# Altium project IBB.PrjPcb (part 4 of 11)

## Sheet Input switch.SchDoc
size A3; SheetNumber: 5; SheetTotal: 8
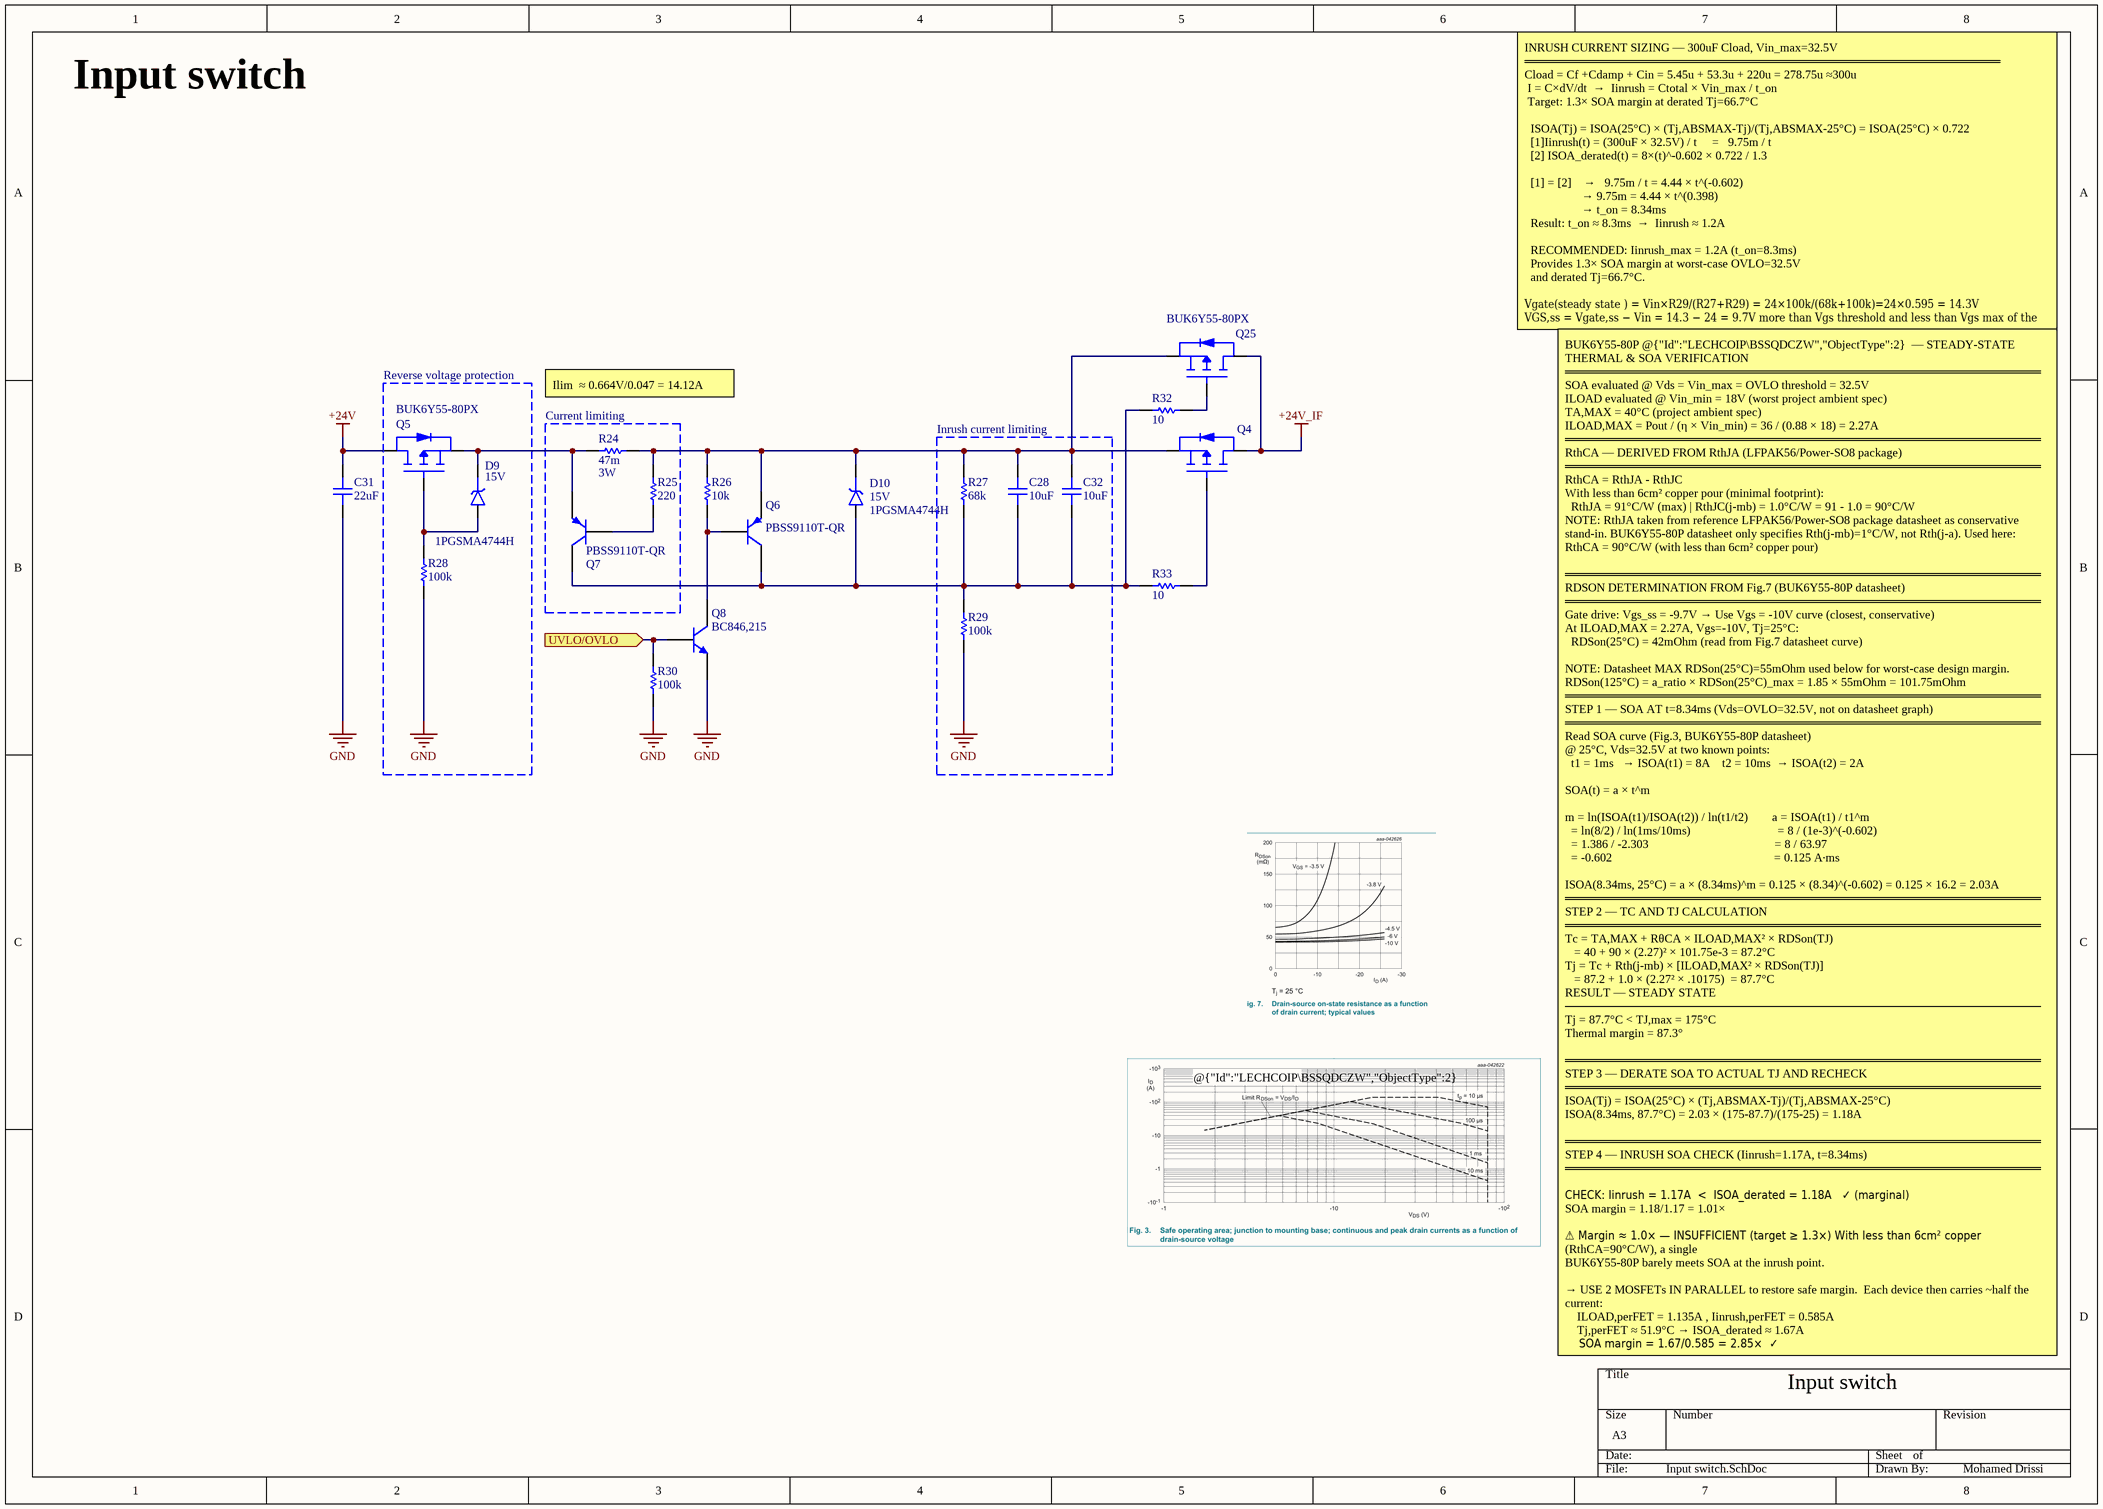
[diagram p3: Input switch.SchDoc]

### Parts
(Parts that share a designator on the sheet are numbered #1, #2 ... from top to bottom, then left to right.)
C28  Capacitance: 10uF  [cap_1210]  (hidden comment: GRM32EC72A106KE05L)
C31#1  Capacitance: 22uF  [CAP_1812]  (hidden comment: GMC43X7R226K50NT)
C32#1  Capacitance: 10uF  [cap_1210]  (hidden comment: GRM32EC72A106KE05L)
D9  1PGSMA4744H  Reference Voltage: 15V  [DO-214AC]
D10  1PGSMA4744H  Reference Voltage: 15V  [DO-214AC]
Q4  BUK6Y55-80PX  [LFPAK56]  (value not drawn)
Q5  BUK6Y55-80PX  [LFPAK56]
Q6  PBSS9110T-QR  [SOT23]
Q7  PBSS9110T-QR  [SOT23]
Q8  BC846,215  [sot23]
Q25  BUK6Y55-80PX  [LFPAK56]
R24  Power Rating: 3W  Resistance: 47m  [RES_1225]  (hidden comment: RLW73PA3FR047TE)
R25  Resistance: 220  [res_0603]  (hidden comment: CRGCQ0603J220R)
R26  Resistance: 10k  [res_0603]  (hidden comment: RC0603FR-0710KL)
R27  Resistance: 68k  [res_0603]  (hidden comment: CRGCQ0603J68K)
R28  Resistance: 100k  [res_0603]  (hidden comment: CRCW0603100KFKEA)
R29  Resistance: 100k  [res_0603]  (hidden comment: CRCW0603100KFKEA)
R30  Resistance: 100k  [res_0603]  (hidden comment: CRCW0603100KFKEA)
R32#1  Resistance: 10  [res_0603]  (hidden comment: RC0603FR-0710RL)
R33#1  Resistance: 10  [res_0603]  (hidden comment: RC0603FR-0710RL)

### Blocks framed on the sheet
Reverse voltage protection: D9 Q5 R28
Current limiting: Q7 R24 R25
Inrush current limiting: C28 C32#1 R27 R29

### Ports
UVLO/OVLO (in, see Main[1B], Protections[2C])

### Nets
+24V: C31#1.2 Q5.MB(D)
+24V_IF: Q4.MB(D) Q25.MB(D)
GND: C31#1.1 Q8.2(E) R28.1 R29.1 R30.1
NetC28_1: C28.1 C32#1.1 D10.A Q6.3(C) Q7.3(C) R27.1 R29.2 R32#1.2 R33#1.2
NetC28_2: C28.2 C32#1.2 D10.C Q4.1(S) Q6.2(E) Q25.1(S) R24.2 R25.2 R26.2 R27.2
NetD9_A: D9.A Q5.4(G) R28.2
NetD9_C: D9.C Q5.1(S) Q7.2(E) R24.1
NetQ4_4: Q4.4(G) R33#1.1
NetQ6_1: Q6.1(B) Q8.3(C) R26.1
NetQ7_1: Q7.1(B) R25.1
NetQ8_1: Q8.1(B) R30.2 ; port UVLO/OVLO
NetQ25_4: Q25.4(G) R32#1.1

### Notes on the sheet
- Input switch
- INRUSH CURRENT SIZING — 300uF Cload, Vin_max=32.5V
  ════════════════════════════════════════════════════════
  Cload = Cf +Cdamp + Cin = 5.45u + 53.3u + 220u = 278.75u ≈300u
  I = C×dV/dt  →  Iinrush = Ctotal × Vin_max / t_on
  Target: 1.3× SOA margin at derated Tj=66.7°C
  ISOA(Tj) = ISOA(25°C) × (Tj,ABSMAX-Tj)/(Tj,ABSMAX-25°C) = ISOA(25°C) × 0.722
  [1]Iinrush(t) = (300uF × 32.5V) / t     =   9.75m / t
  [2] ISOA_derated(t) = 8×(t)^-0.602 × 0.722 / 1.3
  [1] = [2]    →   9.75m / t = 4.44 × t^(-0.602)
  → 9.75m = 4.44 × t^(0.398)
  → t_on = 8.34ms
  Result: t_on ≈ 8.3ms  →  Iinrush ≈ 1.2A
  RECOMMENDED: Iinrush_max = 1.2A (t_on=8.3ms)
  Provides 1.3× SOA margin at worst-case OVLO=32.5V
  and derated Tj=66.7°C.
  Vgate(steady state ) = Vin​×R29​​/(R27​+R29​) = 24×100k​/(68k+100k)=24×0.595 = 14.3V
  VGS,ss ​= Vgate,ss ​− Vin​ = 14.3 − 24 = 9.7V more than Vgs threshold and less than Vgs max of the Mosfet
- Ilim  ≈ 0.664V/0.047 = 14.12A
- @{"Id":"LECHCOIP\BSSQDCZW","ObjectType":2} BUK6Y55-80PX
- BUK6Y55-80P @{"Id":"LECHCOIP\BSSQDCZW","ObjectType":2}  — STEADY-STATE THERMAL & SOA VERIFICATION
  ════════════════════════════════════════════════════════
  SOA evaluated @ Vds = Vin_max = OVLO threshold = 32.5V
  ILOAD evaluated @ Vin_min = 18V (worst project ambient spec)
  TA,MAX = 40°C (project ambient spec)
  ILOAD,MAX = Pout / (η × Vin_min) = 36 / (0.88 × 18) = 2.27A
  ════════════════════════════════════════════════════════
  RthCA — DERIVED FROM RthJA (LFPAK56/Power-SO8 package)
  ════════════════════════════════════════════════════════
  RthCA = RthJA - RthJC
  With less than 6cm² copper pour (minimal footprint):
  RthJA = 91°C/W (max) | RthJC(j-mb) = 1.0°C/W = 91 - 1.0 = 90°C/W
  NOTE: RthJA taken from reference LFPAK56/Power-SO8 package datasheet as conservative
  stand-in. BUK6Y55-80P datasheet only specifies Rth(j-mb)=1°C/W, not Rth(j-a). Used here: RthCA = 90°C/W (with less than 6cm² copper pour)
  ════════════════════════════════════════════════════════
  RDSON DETERMINATION FROM Fig.7 (BUK6Y55-80P datasheet)
  ════════════════════════════════════════════════════════
  Gate drive: Vgs_ss = -9.7V → Use Vgs = -10V curve (closest, conservative)
  At ILOAD,MAX = 2.27A, Vgs=-10V, Tj=25°C:
  RDSon(25°C) = 42mOhm (read from Fig.7 datasheet curve)
  NOTE: Datasheet MAX RDSon(25°C)=55mOhm used below for worst-case design margin.
  RDSon(125°C) = a_ratio × RDSon(25°C)_max = 1.85 × 55mOhm = 101.75mOhm
  ════════════════════════════════════════════════════════
  STEP 1 — SOA AT t=8.34ms (Vds=OVLO=32.5V, not on datasheet graph)
  ════════════════════════════════════════════════════════
  Read SOA curve (Fig.3, BUK6Y55-80P datasheet)
  @ 25°C, Vds=32.5V at two known points:
  t1 = 1ms   → ISOA(t1) = 8A    t2 = 10ms  → ISOA(t2) = 2A
  SOA(t) = a × t^m
  m = ln(ISOA(t1)/ISOA(t2)) / ln(t1/t2)        a = ISOA(t1) / t1^m
  = ln(8/2) / ln(1ms/10ms)                             = 8 / (1e-3)^(-0.602)
  = 1.386 / -2.303                                          = 8 / 63.97
  = -0.602                                                      = 0.125 A·ms
  ISOA(8.34ms, 25°C) = a × (8.34ms)^m = 0.125 × (8.34)^(-0.602) = 0.125 × 16.2 = 2.03A
  ════════════════════════════════════════════════════════
  STEP 2 — TC AND TJ CALCULATION
  ════════════════════════════════════════════════════════
  Tc = TA,MAX + RθCA × ILOAD,MAX² × RDSon(TJ)
  = 40 + 90 × (2.27)² × 101.75e-3 = 87.2°C
  Tj = Tc + Rth(j-mb) × [ILOAD,MAX² × RDSon(TJ)]
  = 87.2 + 1.0 × (2.27² × .10175)  = 87.7°C
  RESULT — STEADY STATE
  ────────────────────────────────────────────────────────
  Tj = 87.7°C < TJ,max = 175°C
  Thermal margin = 87.3°
  ════════════════════════════════════════════════════════
  STEP 3 — DERATE SOA TO ACTUAL TJ AND RECHECK
  ════════════════════════════════════════════════════════
  ISOA(Tj) = ISOA(25°C) × (Tj,ABSMAX-Tj)/(Tj,ABSMAX-25°C)
  ISOA(8.34ms, 87.7°C) = 2.03 × (175-87.7)/(175-25) = 1.18A
  ════════════════════════════════════════════════════════
  STEP 4 — INRUSH SOA CHECK (Iinrush=1.17A, t=8.34ms)
  ════════════════════════════════════════════════════════
  CHECK: Iinrush = 1.17A  <  ISOA_derated = 1.18A   ✓ (marginal)
  SOA margin = 1.18/1.17 = 1.01×
  ⚠ Margin ≈ 1.0× — INSUFFICIENT (target ≥ 1.3×) With less than 6cm² copper (RthCA=90°C/W), a single
  BUK6Y55-80P barely meets SOA at the inrush point.
  → USE 2 MOSFETs IN PARALLEL to restore safe margin.  Each device then carries ~half the current:
  ILOAD,perFET = 1.135A , Iinrush,perFET = 0.585A
  Tj,perFET ≈ 51.9°C → ISOA_derated ≈ 1.67A
  SOA margin = 1.67/0.585 = 2.85×  ✓
- Mohamed Drissi

### Library data of the parts
C28 C32#1 = Murata GRM32EC72A106KE05L: 100V 10uF X7S ±10% 1210 Multilayer Ceramic Capacitors MLCC - SMD/SMT ROHS; Manufacturer: Murata; Manufacturer Lifecycle Status: IN PRODUCTION; Supplier: RS; Supplier Part Number: 2478166P; Manufacturer Part Number: GRM32EC72A106KE05L; RoHS: Compliant; Category: Ceramic Capacitors; Stock: 6445; Pricing: 25=1,014, 50=0,9, 500=0,79 (EUR); Case/Package: 1210; Dielectric: X7S; Dielectric Material: Ceramic; Height: 2.5mm; Length: 3.2mm; Lifecycle Status: Production; Material: Ceramic; Max Operating Temperature: 125°C; Min Operating Temperature: -55°C; Mounting Technology: Surface Mount; Number of Terminals: 2; REACH SVHC: Yes; Schedule B: 8532240020, 8532240020|8532240020|8532240020|8532240020|8532240020|8532240020|8532240020|8532240020|8532240020|8532240020|8532240020|8532240020|8532240020|8532240020|8532240020|8532240020|8532240020|8532240020|8532240020|8532240020|8532240020|8532240020|8532240020|85; Thickness: 2.5mm; Tolerance: 10%; Voltage Rating: 100V; Voltage Rating (DC): 100V; Width: 2.5mm; ComponentLink1URL: https://datasheet.octopart.com:443/GRM32EC72A106KE05L-Murata-datasheet-141281477.pdf?src-supplier=Geoflip; ComponentLink1Description: https://datasheet.octopart.com:443/GRM32EC72A106KE05L-Murata-datasheet-141281477.pdf?src-supplier=Geoflip; ComponentLink2URL: https://datasheet.octopart.com:443/GRM32EC72A106KE05L-Murata-datasheet-165579666.pdf?src-supplier=TME; ComponentLink2Description: https://datasheet.octopart.com:443/GRM32EC72A106KE05L-Murata-datasheet-165579666.pdf?src-supplier=TME; ComponentLink3URL: https://datasheet.octopart.com:443/GRM32EC72A106KE05L-Murata-datasheet-140709574.pdf?src-supplier=Ciiva; ComponentLink3Description: https://datasheet.octopart.com:443/GRM32EC72A106KE05L-Murata-datasheet-140709574.pdf?src-supplier=Ciiva; ComponentLink4URL: https://datasheet.octopart.com:443/GRM32EC72A106KE05L-Murata-datasheet-138746841.pdf?src-supplier=Ciiva; ComponentLink4Description: https://datasheet.octopart.com:443/GRM32EC72A106KE05L-Murata-datasheet-138746841.pdf?src-supplier=Ciiva; ComponentLink5URL: https://datasheet.octopart.com:443/GRM32EC72A106KE05L-Murata-datasheet-102370999.pdf?src-supplier=HQonline; ComponentLink5Description: https://datasheet.octopart.com:443/GRM32EC72A106KE05L-Murata-datasheet-102370999.pdf?src-supplier=HQonline; ComponentLink6URL: https://datasheet.octopart.com/GRM32EC72A106KE05L-Murata-datasheet-12515295.pdf; ComponentLink6Description: https://datasheet.octopart.com/GRM32EC72A106KE05L-Murata-datasheet-12515295.pdf; ComponentLink7URL: https://datasheet.octopart.com/GRM32EC72A106KE05L-Murata-datasheet-12510076.pdf; ComponentLink7Description: https://datasheet.octopart.com/GRM32EC72A106KE05L-Murata-datasheet-12510076.pdf; ComponentLink8URL: https://datasheet.octopart.com/GRM32EC72A106KE05L-Murata-datasheet-11978611.pdf; ComponentLink8Description: https://datasheet.octopart.com/GRM32EC72A106KE05L-Murata-datasheet-11978611.pdf; ComponentLink9URL: https://datasheet.octopart.com/GRM32EC72A106KE05L-Murata-datasheet-10025737.pdf; ComponentLink9Description: https://datasheet.octopart.com/GRM32EC72A106KE05L-Murata-datasheet-10025737.pdf; ComponentLink10URL: https://datasheet.octopart.com/GRM32EC72A106KE05L-Murata-datasheet-8819587.pdf; ComponentLink10Description: https://datasheet.octopart.com/GRM32EC72A106KE05L-Murata-datasheet-8819587.pdf; ComponentLink11URL: http://sigma.octopart.com:80/reach_statement/Murata-company-16.pdf?src-supplier=Compliance+Statements; ComponentLink11Description: http://sigma.octopart.com:80/reach_statement/Murata-company-16.pdf?src-supplier=Compliance+Statements
C31#1 = Cal-chip GMC43X7R226K50NT: 1812 Mlcc 22UF 50V 10% X7R; Manufacturer: Cal-Chip Electronics; Supplier: DigiKey; Supplier Part Number: 4713-GMC43X7R226K50NTTR-ND; Manufacturer Part Number: GMC43X7R226K50NT; Category: Ceramic Capacitors; Stock: 3500; Pricing: 500=0,68284, 1000=0,64805, 1500=0,63062, 2500=0,61131, 3500=0,60001, 5000=0,58915 (USD)
D9 D10 = Taiwan semiconductor 1PGSMA4744H: Zener Diode, 15V V(Z), 5%, 1W, Silicon, Unidirectional, DO-214AC; Impedance: 14Ω; Number of Elements: 1; Peak Reverse Current: 1µA; Reverse Standoff Voltage: 11.4V; Zener Current: 17mA; Supplier: DigiKey; Supplier Part Number: 1801-1PGSMA4744HTR-ND; Manufacturer: Taiwan Semiconductor; Manufacturer Part Number: 1PGSMA4744H; RoHS: Compliant; Category: Zener Diodes; Stock: 7500; Pricing: 7500=0,09278, 15000=0,08793 (USD); China RoHS: Non-Compliant; Composition: Zener; Country of Origin: Mainland China, Taiwan; Export Control Classification Number (ECCN) Code: EAR99; Harmonized Tariff Schedule (HTS) Code: 8541.10.00.50; Introduction Date: 2021-03-02; Lifecycle Status: Production; Max Operating Temperature: 175°C; Max Power Dissipation: 1W; Min Operating Temperature: -55°C; Number of Terminals: 2; Polarity: Unidirectional; Ratings: AEC-Q101; REACH SVHC: No; Voltage Tolerance: 5%; ComponentLink1URL: https://datasheet.octopart.com:443/1PGSMA4744H-Taiwan-Semiconductor-datasheet-181255874.pdf?src-supplier=IHS; ComponentLink1Description: https://datasheet.octopart.com:443/1PGSMA4744H-Taiwan-Semiconductor-datasheet-181255874.pdf?src-supplier=IHS
Q4 Q5 Q25 = Nexp BUK6Y55-80PX: 80 V, P-channel Trench MOSFET; Manufacturer: Nexperia; Supplier: DigiKey; Supplier Part Number: 1727-BUK6Y55-80PXCT-ND; Manufacturer Part Number: BUK6Y55-80PX; RoHS: Compliant; Category: MOSFETs; Stock: 1568; Pricing: 1=1,14, 10=0,826, 25=0,7464, 100=0,6593, 250=0,61776, 500=0,59272 (USD); China RoHS: Non-Compliant; Export Control Classification Number (ECCN) Code: EAR99; Introduction Date: 2025-05-08; Lifecycle Status: Production; REACH SVHC: No
Q6 Q7 = NXP PBSS9110T-QR: Bipolar Transistors - BJT 100 V, 1 A PNP low VCEsat transistor; Manufacturer: Nexperia; Manufacturer Lifecycle Status: RELEASED FOR SUPPLY; Supplier: DigiKey; Supplier Part Number: 1727-PBSS9110T-QRTR-ND; Manufacturer Part Number: PBSS9110T-QR; Category: Uncategorized; Stock: 6000; Pricing: 3000=0,08942, 6000=0,08095, 9000=0,07663, 15000=0,07178, 21000=0,07176 (USD); Lifecycle Status: Production; ComponentLink1URL: https://datasheet.octopart.com:443/PBSS9110T-QR-Nexperia-datasheet-163260084.pdf?src-supplier=Nexperia; ComponentLink1Description: https://datasheet.octopart.com:443/PBSS9110T-QR-Nexperia-datasheet-163260084.pdf?src-supplier=Nexperia
Q8 = NXP BC846,215: BC846 Series 65 V 100 mA SMT NPN General Purpose Transistor - SOT-23; Manufacturer: Nexperia; Manufacturer Lifecycle Status: RELEASED FOR SUPPLY; Collector Base Voltage (VCBO): 80V; Collector Emitter Breakdown Voltage: 65V; Collector Emitter Saturation Voltage: 600mV; Element Configuration: Single; Emitter Base Voltage (VEBO): 6V; Frequency: 100MHz; hFE Min: 110; Max Collector Current: 100mA; Max Power Dissipation: 250mW; Number of Elements: 1; Supplier: RS; Supplier Part Number: 4842268P; Manufacturer Part Number: BC846,215; RoHS: Compliant; Category: BJTs; Stock: 24450; Pricing: 100=0,103, 250=0,091 (EUR); Case/Package: SOT-23; China RoHS: Compliant; Collector Emitter Voltage (VCEO): 65V; Contact Plating: Tin; Country of Origin: Mainland China; Export Control Classification Number (ECCN) Code: EAR99; Gain Bandwidth Product: 100MHz; Height: 1mm; Harmonized Tariff Schedule (HTS) Code: 8541.21.00.95; Introduction Date: 1997-09-01; Lead Free: Lead Free; Length: 3mm; Lifecycle Status: Production; Max Breakdown Voltage: 65V; Clock Frequency: 100MHz; Max Operating Temperature: 150°C; Min Operating Temperature: -65°C; Mounting Technology: Surface Mount; Pins: 3; Number of Terminals: 3; Packaging: Cut Tape; Polarity: NPN; Power Dissipation: 250mW; Radiation Hardening: No; REACH SVHC: Yes; Schedule B: 8541210080, 8541210080|8541210080|8541210080|8541210080|8541210080|8541210080|8541210080|8541210080|8541210080|8541210080|8541210080|8541210080|8541210080|8541210080|8541210080|8541210080|8541210080, 8541210080|8541210080|8541210080|8541210080|8541210080|8541210080|8541210080|8541210080|8541210080|8541210080|8541210080|8541210080|8541210080|8541210080|8541210080|8541210080|8541210080|8541210080, 8541210080|8541210080|8541210080|8541210080|8541210080|8541210080|8541210080|8541210080|8541210080|8541210080|8541210080|8541210080|8541210080|8541210080|8541210080|8541210080|8541210080|8541210080|8541210080; Transition Frequency: 100MHz; Weight: 4.535924g; Width: 1.4mm; ComponentLink1URL: https://datasheet.octopart.com:443/BC846%2C215-Nexperia-datasheet-158761168.pdf?src-supplier=Future+Electronics; ComponentLink1Description: https://datasheet.octopart.com:443/BC846%2C215-Nexperia-datasheet-158761168.pdf?src-supplier=Future+Electronics; ComponentLink2URL: https://datasheet.octopart.com:443/BC846%2C215-Nexperia-datasheet-12520503.pdf?src-supplier=IHS; ComponentLink2Description: https://datasheet.octopart.com:443/BC846%2C215-Nexperia-datasheet-12520503.pdf?src-supplier=IHS; ComponentLink3URL: https://datasheet.octopart.com:443/BC846%2C215-Nexperia-datasheet-116120539.pdf?src-supplier=IHS; ComponentLink3Description: https://datasheet.octopart.com:443/BC846%2C215-Nexperia-datasheet-116120539.pdf?src-supplier=IHS; ComponentLink4URL: https://datasheet.octopart.com:443/BC846%2C215-Nexperia-datasheet-87580894.pdf?src-supplier=Newark; ComponentLink4Description: https://datasheet.octopart.com:443/BC846%2C215-Nexperia-datasheet-87580894.pdf?src-supplier=Newark; ComponentLink5URL: https://datasheet.octopart.com:443/BC846%2C215-NXP-Semiconductors-datasheet-8530246.pdf?src-supplier=Arrow+Electronics; ComponentLink5Description: https://datasheet.octopart.com:443/BC846%2C215-NXP-Semiconductors-datasheet-8530246.pdf?src-supplier=Arrow+Electronics; ComponentLink6URL: https://datasheet.octopart.com:443/BC846%2C215-NXP-Semiconductors-datasheet-20734450.pdf?src-supplier=Farnell; ComponentLink6Description: https://datasheet.octopart.com:443/BC846%2C215-NXP-Semiconductors-datasheet-20734450.pdf?src-supplier=Farnell; ComponentLink7URL: http://sigma.octopart.com:80/reach_statement/NXP-Semiconductors-company-13.pdf?src-supplier=Compliance+Statements; ComponentLink7Description: http://sigma.octopart.com:80/reach_statement/NXP-Semiconductors-company-13.pdf?src-supplier=Compliance+Statements; ComponentLink8URL: http://sigma.octopart.com:80/rohs_statement/NXP-Semiconductors-company-12.pdf?src-supplier=Compliance+Statements; ComponentLink8Description: http://sigma.octopart.com:80/rohs_statement/NXP-Semiconductors-company-12.pdf?src-supplier=Compliance+Statements
R24 = TE RLW73PA3FR047TE: Fixed Resistor, Metal Glaze/thick Film, 3W, 1% +/-Tol, 200ppm/Cel, 1225; Manufacturer: TE Connectivity; Manufacturer Lifecycle Status: ACTIVE; Temperature Coefficient: 200ppm/°C; Supplier: DigiKey; Supplier Part Number: 1712-RLW73PA3FR047TECT-ND; Manufacturer Part Number: RLW73PA3FR047TE; RoHS: Compliant; Category: Chip SMD Resistors; Stock: 11863; Pricing: 1=0,99, 10=0,644, 25=0,5504, 50=0,4916, 100=0,4417, 250=0,38696, 500=0,3527, 1000=0,32356 (USD); Case/Package: 1225; China RoHS: Compliant; Composition: Thick Film; Export Control Classification Number (ECCN) Code: EAR99; Introduction Date: 2025-09-27; Lifecycle Status: Production; Max Operating Temperature: 155°C; Min Operating Temperature: -55°C; Number of Terminals: 2; REACH SVHC: Yes; Tolerance: 1%; ComponentLink1URL: https://datasheet.octopart.com:443/RLW73PA3FR047TE-TE-Connectivity-datasheet-184924788.pdf?src-supplier=IHS; ComponentLink1Description: https://datasheet.octopart.com:443/RLW73PA3FR047TE-TE-Connectivity-datasheet-184924788.pdf?src-supplier=IHS; ComponentLink2URL: https://datasheet.octopart.com:443/RLW73PA3FR047TE-TE-Connectivity-datasheet-166578570.pdf?src-supplier=Electro+Sonic; ComponentLink2Description: https://datasheet.octopart.com:443/RLW73PA3FR047TE-TE-Connectivity-datasheet-166578570.pdf?src-supplier=Electro+Sonic; ComponentLink3URL: https://datasheet.octopart.com:443/RLW73PA3FR047TE-TE-Connectivity-datasheet-166578571.pdf?src-supplier=TE+Connectivity; ComponentLink3Description: https://datasheet.octopart.com:443/RLW73PA3FR047TE-TE-Connectivity-datasheet-166578571.pdf?src-supplier=TE+Connectivity; ComponentLink4URL: https://sigma.octopart.com:443/166578626/technical_drawing/TE-Connectivity-RLW73PA3FR047TE.pdf?src-supplier=TE+Connectivity; ComponentLink4Description: https://sigma.octopart.com:443/166578626/technical_drawing/TE-Connectivity-RLW73PA3FR047TE.pdf?src-supplier=TE+Connectivity
R25 = TE CRGCQ0603J220R: Res Thick Film 0603 220 Ohm 5% 0.1W(1/10W) ±100ppm/C Pad SMD Automotive T/R; Manufacturer: TE Connectivity; Manufacturer Lifecycle Status: ACTIVE; Operating Supply Voltage: 75V; Power Rating: 100mW; Temperature Coefficient: 100ppm/°C; Supplier: Farnell; Supplier Part Number: CRGCQ0603J220R; Manufacturer Part Number: CRGCQ0603J220R; RoHS: Compliant; Category: Chip SMD Resistors; Stock: 13500; Pricing: 10=0,010, 250=0,0053, 1000=0,0035, 5000=0,003, 10000=0,0023, 20000=0,0022 (GBP); Ambient Temperature Range High: 70°C; Case/Package: 0603; China RoHS: Non-Compliant; Composition: Thick Film; Export Control Classification Number (ECCN) Code: EAR99; Height: 450µm; Harmonized Tariff Schedule (HTS) Code: 8533.21.00.30; Introduction Date: 2018-03-13; Length: 1.6mm; Lifecycle Status: Production; Max Operating Temperature: 155°C; Min Operating Temperature: -55°C; Mounting Technology: Surface Mount; Number of Terminals: 2; Packaging: Cut Tape; Ratings: AEC-Q200; REACH SVHC: Yes; Schedule B: 8533210025, 8533210025|8533210025|8533210025|8533210025|8533210025, 8533210045; Tolerance: 5%; Voltage Rating: 75V; Voltage Rating (DC): 75V; Width: 800µm; Working Voltage: 75V; ComponentLink1URL: https://datasheet.octopart.com:443/CRGCQ0603J220R-TE-Connectivity-datasheet-114679081.pdf?src-supplier=Master+Electronics; ComponentLink1Description: https://datasheet.octopart.com:443/CRGCQ0603J220R-TE-Connectivity-datasheet-114679081.pdf?src-supplier=Master+Electronics; ComponentLink2URL: https://datasheet.octopart.com:443/CRGCQ0603J220R-TE-Connectivity-datasheet-179146981.pdf?src-supplier=IHS; ComponentLink2Description: https://datasheet.octopart.com:443/CRGCQ0603J220R-TE-Connectivity-datasheet-179146981.pdf?src-supplier=IHS; ComponentLink3URL: https://sigma.octopart.com:443/114692702/technical_drawing/TE-Connectivity-CRGCQ0603J220R.pdf?src-supplier=Sager+Electronics; ComponentLink3Description: https://sigma.octopart.com:443/114692702/technical_drawing/TE-Connectivity-CRGCQ0603J220R.pdf?src-supplier=Sager+Electronics
R26 = YAGEO RC0603FR-0710KL: 100mW Thick Film Resistors ±100ppm/℃ ±1% 10kΩ 0603 Chip Resistor - Surface Mount ROHS; Manufacturer: Yageo Group; Temperature Coefficient: 100ppm/°C; Voltage Rating: 75V; Voltage Rating (DC): 50V; Supplier: RS; Supplier Part Number: 1995443P; Manufacturer Part Number: RC0603FR-0710KL; RoHS: Compliant; Category: Chip SMD Resistors; Stock: 39200; Pricing: 1000=0,007, 2500=0,007, 5000=0,006, 10000=0,006 (EUR); Case/Package: 0603; Case Code (Imperial): 0603; Case Code (Metric): 0603; China RoHS: Non-Compliant; Composition: Thick Film; Contact Plating: Tin; Depth: 800µm; Height: 450µm; Lead Free: Lead Free; Lead Pitch: 300µm; Length: 1.6mm; Lifecycle Status: Production; Max Operating Temperature: 155°C; Military Standard: Not; Min Operating Temperature: -55°C; Mounting Technology: Surface Mount; Pins: 2; Number of Terminals: 2; Packaging: Tape & Reel; Power Rating: 100mW; Radiation Hardening: No; REACH SVHC: Yes; Schedule B: 8533210045, 8533210045|8533210045|8533210045|8533210045|8533210045|8533210045|8533210045|8533210045|8533210045|8533210045|8533210045|8533210045|8533210045|8533210045|8533210045|8533210045|8533210045|8533210045|8533210045|8533210045|8533210045|8533210045|8533210045|85; Termination: SMD/SMT; Tolerance: 1%; Weight: 2.012816mg; Width: 800µm; Working Voltage: 75V; ComponentLink1URL: https://datasheet.octopart.com:443/RC0603FR-0710KL-Yageo-datasheet-175887523.pdf?src-supplier=IHS; ComponentLink1Description: https://datasheet.octopart.com:443/RC0603FR-0710KL-Yageo-datasheet-175887523.pdf?src-supplier=IHS; ComponentLink2URL: https://datasheet.octopart.com:443/RC0603FR-0710KL-Yageo-datasheet-103092701.pdf?src-supplier=Upverter; ComponentLink2Description: https://datasheet.octopart.com:443/RC0603FR-0710KL-Yageo-datasheet-103092701.pdf?src-supplier=Upverter; ComponentLink3URL: https://datasheet.octopart.com:443/RC0603FR-0710KL-Yageo-datasheet-98239111.pdf?src-supplier=Upverter; ComponentLink3Description: https://datasheet.octopart.com:443/RC0603FR-0710KL-Yageo-datasheet-98239111.pdf?src-supplier=Upverter; ComponentLink4URL: https://datasheet.octopart.com:443/RC0603FR-0710KL-Yageo-datasheet-141265859.pdf?src-supplier=Upverter; ComponentLink4Description: https://datasheet.octopart.com:443/RC0603FR-0710KL-Yageo-datasheet-141265859.pdf?src-supplier=Upverter; ComponentLink5URL: https://sigma.octopart.com:443/138820526/technical_drawing/Yageo-RC0603FR-0710KL.pdf?src-supplier=Upverter; ComponentLink5Description: https://sigma.octopart.com:443/138820526/technical_drawing/Yageo-RC0603FR-0710KL.pdf?src-supplier=Upverter; ComponentLink6URL: https://datasheet.octopart.com:443/RC0603FR-0710KL-Yageo-datasheet-8328172.pdf?src-supplier=Farnell; ComponentLink6Description: https://datasheet.octopart.com:443/RC0603FR-0710KL-Yageo-datasheet-8328172.pdf?src-supplier=Farnell; ComponentLink7URL: https://datasheet.octopart.com:443/RC0603FR-0710KL-Yageo-datasheet-13691069.pdf?src-supplier=Farnell; ComponentLink7Description: https://datasheet.octopart.com:443/RC0603FR-0710KL-Yageo-datasheet-13691069.pdf?src-supplier=Farnell; ComponentLink8URL: https://datasheet.octopart.com:443/RC0603FR-0710KL-Yageo-datasheet-62067350.pdf?src-supplier=element14+APAC; ComponentLink8Description: https://datasheet.octopart.com:443/RC0603FR-0710KL-Yageo-datasheet-62067350.pdf?src-supplier=element14+APAC; ComponentLink9URL: https://datasheet.octopart.com:443/RC0603FR-0710KL-Yageo-datasheet-17842380.pdf?src-supplier=element14+APAC; ComponentLink9Description: https://datasheet.octopart.com:443/RC0603FR-0710KL-Yageo-datasheet-17842380.pdf?src-supplier=element14+APAC; ComponentLink10URL: https://datasheet.octopart.com:443/RC0603FR-0710KL-Yageo-datasheet-15599030.pdf?src-supplier=Future+Electronics; ComponentLink10Description: https://datasheet.octopart.com:443/RC0603FR-0710KL-Yageo-datasheet-15599030.pdf?src-supplier=Future+Electronics; ComponentLink11URL: https://datasheet.octopart.com:443/RC0603FR-0710KL-Yageo-Group-datasheet-176638170.pdf?src-supplier=Future+Electronics; ComponentLink11Description: https://datasheet.octopart.com:443/RC0603FR-0710KL-Yageo-Group-datasheet-176638170.pdf?src-supplier=Future+Electronics; ComponentLink12URL: https://datasheet.octopart.com:443/RC0603FR-0710KL-Yageo-datasheet-164759695.pdf?src-supplier=Future+Electronics; ComponentLink12Description: https://datasheet.octopart.com:443/RC0603FR-0710KL-Yageo-datasheet-164759695.pdf?src-supplier=Future+Electronics; ComponentLink13URL: https://datasheet.octopart.com:443/RC0603FR-0710KL-Yageo-datasheet-127823281.pdf?src-supplier=Future+Electronics; ComponentLink13Description: https://datasheet.octopart.com:443/RC0603FR-0710KL-Yageo-datasheet-127823281.pdf?src-supplier=Future+Electronics; ComponentLink14URL: https://datasheet.octopart.com:443/RC0603FR-0710KL-Yageo-datasheet-137700087.pdf?src-supplier=Future+Electronics; ComponentLink14Description: https://datasheet.octopart.com:443/RC0603FR-0710KL-Yageo-datasheet-137700087.pdf?src-supplier=Future+Electronics; ComponentLink15URL: https://datasheet.octopart.com:443/RC0603FR-0710KL-Yageo-datasheet-27584510.pdf?src-supplier=Future+Electronics; ComponentLink15Description: https://datasheet.octopart.com:443/RC0603FR-0710KL-Yageo-datasheet-27584510.pdf?src-supplier=Future+Electronics; ComponentLink16URL: https://datasheet.octopart.com:443/RC0603FR-0710KL-Yageo-datasheet-8324193.pdf?src-supplier=Future+Electronics; ComponentLink16Description: https://datasheet.octopart.com:443/RC0603FR-0710KL-Yageo-datasheet-8324193.pdf?src-supplier=Future+Electronics; ComponentLink17URL: https://datasheet.octopart.com:443/RC0603FR-0710KL-Yageo-datasheet-12596169.pdf?src-supplier=Newark; ComponentLink17Description: https://datasheet.octopart.com:443/RC0603FR-0710KL-Yageo-datasheet-12596169.pdf?src-supplier=Newark; ComponentLink18URL: https://datasheet.octopart.com:443/RC0603FR-0710KL-Yageo-datasheet-503470.pdf?src-supplier=Newark; ComponentLink18Description: https://datasheet.octopart.com:443/RC0603FR-0710KL-Yageo-datasheet-503470.pdf?src-supplier=Newark; ComponentLink19URL: https://datasheet.octopart.com:443/RC0603FR-0710KL-Yageo-datasheet-34211833.pdf?src-supplier=Newark; ComponentLink19Description: https://datasheet.octopart.com:443/RC0603FR-0710KL-Yageo-datasheet-34211833.pdf?src-supplier=Newark; ComponentLink20URL: https://datasheet.octopart.com:443/RC0603FR-0710KL-Yageo-datasheet-79472498.pdf?src-supplier=Megastar; ComponentLink20Description: https://datasheet.octopart.com:443/RC0603FR-0710KL-Yageo-datasheet-79472498.pdf?src-supplier=Megastar; ComponentLink21URL: https://datasheet.octopart.com/RC0603FR-0710KL-Yageo-datasheet-73766026.pdf; ComponentLink21Description: https://datasheet.octopart.com/RC0603FR-0710KL-Yageo-datasheet-73766026.pdf; ComponentLink22URL: https://datasheet.octopart.com:443/RC0603FR-0710KL-Yageo-datasheet-118562.pdf?src-supplier=DigiKey; ComponentLink22Description: https://datasheet.octopart.com:443/RC0603FR-0710KL-Yageo-datasheet-118562.pdf?src-supplier=DigiKey; ComponentLink23URL: http://sigma.octopart.com:80/conflict_mineral_statement/Yageo-company-3.pdf?src-supplier=Compliance+Statements; ComponentLink23Description: http://sigma.octopart.com:80/conflict_mineral_statement/Yageo-company-3.pdf?src-supplier=Compliance+Statements; ComponentLink24URL: http://sigma.octopart.com:80/rohs_statement/Yageo-company-2.pdf?src-supplier=Compliance+Statements; ComponentLink24Description: http://sigma.octopart.com:80/rohs_statement/Yageo-company-2.pdf?src-supplier=Compliance+Statements
R27 = TE CRGCQ0603J68K: Res Thick Film 0603 68K Ohm 5% 0.1W(1/10W) ±100ppm/C Pad SMD Automotive T/R; Manufacturer: TE Connectivity; Manufacturer Lifecycle Status: ACTIVE; Operating Supply Voltage: 75V; Power Rating: 100mW; Temperature Coefficient: 100ppm/°C; Supplier: Farnell; Supplier Part Number: CRGCQ0603J68K; Manufacturer Part Number: CRGCQ0603J68K; RoHS: Compliant; Category: Chip SMD Resistors; Stock: 5233; Pricing: 10=0,010, 250=0,0053, 1000=0,0035, 5000=0,003, 12000=0,0023, 24000=0,0022 (GBP); Ambient Temperature Range High: 70°C; Case/Package: 0603; China RoHS: Non-Compliant; Composition: Thick Film; Export Control Classification Number (ECCN) Code: EAR99; Height: 450µm; Harmonized Tariff Schedule (HTS) Code: 8533.21.00.30; Introduction Date: 2018-03-13; Length: 1.6mm; Lifecycle Status: Production; Max Operating Temperature: 155°C; Min Operating Temperature: -55°C; Mounting Technology: Surface Mount; Number of Terminals: 2; Packaging: Cut Tape; Ratings: AEC-Q200; REACH SVHC: Yes; Schedule B: 8533210045; Tolerance: 5%; Voltage Rating: 75V; Voltage Rating (DC): 75V; Width: 800µm; Working Voltage: 75V; ComponentLink1URL: https://datasheet.octopart.com:443/CRGCQ0603J68K-TE-Connectivity-datasheet-114679081.pdf?src-supplier=Master+Electronics; ComponentLink1Description: https://datasheet.octopart.com:443/CRGCQ0603J68K-TE-Connectivity-datasheet-114679081.pdf?src-supplier=Master+Electronics; ComponentLink2URL: https://sigma.octopart.com:443/114692702/technical_drawing/TE-Connectivity-CRGCQ0603J68K.pdf?src-supplier=Sager+Electronics; ComponentLink2Description: https://sigma.octopart.com:443/114692702/technical_drawing/TE-Connectivity-CRGCQ0603J68K.pdf?src-supplier=Sager+Electronics
R28-R30 = Vishay CRCW0603100KFKEAHP: Res Thick Film 0603 100K Ohm 1% 1/3W ±100ppm/°C Molded SMD SMD Paper T/R; Manufacturer: Vishay; Max Power Dissipation: 250mW; Power Rating: 330mW; Voltage Rating: 75V; Supplier: RS; Supplier Part Number: 8206745P; Manufacturer Part Number: CRCW0603100KFKEAHP; RoHS: Compliant; Category: Chip SMD Resistors; Stock: 5725; Pricing: 25=0,036 (EUR); Case/Package: 0603; Case Code (Imperial): 0603; Case Code (Metric): 1608; China RoHS: Non-Compliant; Composition: Thick Film; Contact Plating: Tin; Country of Origin: Israel; Depth: 850µm; Export Control Classification Number (ECCN) Code: EAR99; Features: Automotive AEC-Q200; Height: 450µm; Harmonized Tariff Schedule (HTS) Code: 8533.21.00.30; Introduction Date: 2008-07-29; Lead Free: Lead Free; Length: 1.6mm; Lifecycle Status: Production; Max Operating Temperature: 155°C; Military Standard: Not; Min Operating Temperature: -55°C; Mounting Technology: Surface Mount; Pins: 2; Number of Terminals: 2; Number of Terminations: 2; Packaging: Cut Tape; Radiation Hardening: No; Ratings: AEC-Q200; REACH SVHC: Yes; Schedule B: 8533210045, 8533210045|8533210045|8533210045|8533210045|8533210045; Temperature Coefficient: 100ppm/°C; Termination: SMD/SMT; Tolerance: 1%; Voltage Rating (DC): 75V; Weight: 2.012816mg; Width: 850µm; Working Voltage: 75V; ComponentLink1URL: https://datasheet.octopart.com:443/CRCW0603100KFKEAHP-Vishay-datasheet-13148866.pdf?src-supplier=Future+Electronics; ComponentLink1Description: https://datasheet.octopart.com:443/CRCW0603100KFKEAHP-Vishay-datasheet-13148866.pdf?src-supplier=Future+Electronics; ComponentLink2URL: https://datasheet.octopart.com:443/CRCW0603100KFKEAHP-Vishay-datasheet-13131392.pdf?src-supplier=Future+Electronics; ComponentLink2Description: https://datasheet.octopart.com:443/CRCW0603100KFKEAHP-Vishay-datasheet-13131392.pdf?src-supplier=Future+Electronics; ComponentLink3URL: https://datasheet.octopart.com:443/CRCW0603100KFKEAHP-Vishay-datasheet-12593106.pdf?src-supplier=Future+Electronics; ComponentLink3Description: https://datasheet.octopart.com:443/CRCW0603100KFKEAHP-Vishay-datasheet-12593106.pdf?src-supplier=Future+Electronics; ComponentLink4URL: https://datasheet.octopart.com:443/CRCW0603100KFKEAHP-Vishay-datasheet-12531795.pdf?src-supplier=Future+Electronics; ComponentLink4Description: https://datasheet.octopart.com:443/CRCW0603100KFKEAHP-Vishay-datasheet-12531795.pdf?src-supplier=Future+Electronics; ComponentLink5URL: https://datasheet.octopart.com:443/CRCW0603100KFKEAHP-Vishay-datasheet-12518686.pdf?src-supplier=Future+Electronics; ComponentLink5Description: https://datasheet.octopart.com:443/CRCW0603100KFKEAHP-Vishay-datasheet-12518686.pdf?src-supplier=Future+Electronics; ComponentLink6URL: https://datasheet.octopart.com:443/CRCW0603100KFKEAHP-Vishay-datasheet-12509906.pdf?src-supplier=Future+Electronics; ComponentLink6Description: https://datasheet.octopart.com:443/CRCW0603100KFKEAHP-Vishay-datasheet-12509906.pdf?src-supplier=Future+Electronics; ComponentLink7URL: https://datasheet.octopart.com:443/CRCW0603100KFKEAHP-Vishay-datasheet-10669844.pdf?src-supplier=Future+Electronics; ComponentLink7Description: https://datasheet.octopart.com:443/CRCW0603100KFKEAHP-Vishay-datasheet-10669844.pdf?src-supplier=Future+Electronics; ComponentLink8URL: https://datasheet.octopart.com:443/CRCW0603100KFKEAHP-Vishay-datasheet-8703221.pdf?src-supplier=Future+Electronics; ComponentLink8Description: https://datasheet.octopart.com:443/CRCW0603100KFKEAHP-Vishay-datasheet-8703221.pdf?src-supplier=Future+Electronics; ComponentLink9URL: https://datasheet.octopart.com:443/CRCW0603100KFKEAHP-Vishay-datasheet-62316122.pdf?src-supplier=Future+Electronics; ComponentLink9Description: https://datasheet.octopart.com:443/CRCW0603100KFKEAHP-Vishay-datasheet-62316122.pdf?src-supplier=Future+Electronics; ComponentLink10URL: https://datasheet.octopart.com:443/CRCW0603100KFKEAHP-Vishay-datasheet-12544674.pdf?src-supplier=_legacy+Avnet; ComponentLink10Description: https://datasheet.octopart.com:443/CRCW0603100KFKEAHP-Vishay-datasheet-12544674.pdf?src-supplier=_legacy+Avnet; ComponentLink11URL: https://datasheet.octopart.com:443/CRCW0603100KFKEAHP-Vishay-datasheet-87136057.pdf?src-supplier=Newark; ComponentLink11Description: https://datasheet.octopart.com:443/CRCW0603100KFKEAHP-Vishay-datasheet-87136057.pdf?src-supplier=Newark; ComponentLink12URL: https://datasheet.octopart.com:443/CRCW0603100KFKEAHP-Vishay-datasheet-66581887.pdf?src-supplier=Newark; ComponentLink12Description: https://datasheet.octopart.com:443/CRCW0603100KFKEAHP-Vishay-datasheet-66581887.pdf?src-supplier=Newark; ComponentLink13URL: https://datasheet.octopart.com:443/CRCW0603100KFKEAHP-Vishay-datasheet-37143532.pdf?src-supplier=Newark; ComponentLink13Description: https://datasheet.octopart.com:443/CRCW0603100KFKEAHP-Vishay-datasheet-37143532.pdf?src-supplier=Newark; ComponentLink14URL: https://datasheet.octopart.com:443/CRCW0603100KFKEAHP-Vishay-datasheet-8359436.pdf?src-supplier=Newark; ComponentLink14Description: https://datasheet.octopart.com:443/CRCW0603100KFKEAHP-Vishay-datasheet-8359436.pdf?src-supplier=Newark; ComponentLink15URL: https://datasheet.octopart.com:443/CRCW0603100KFKEAHP-Vishay-datasheet-112276998.pdf?src-supplier=Newark; ComponentLink15Description: https://datasheet.octopart.com:443/CRCW0603100KFKEAHP-Vishay-datasheet-112276998.pdf?src-supplier=Newark; ComponentLink16URL: https://datasheet.octopart.com:443/CRCW0603100KFKEAHP-Vishay-datasheet-62317933.pdf?src-supplier=element14+APAC; ComponentLink16Description: https://datasheet.octopart.com:443/CRCW0603100KFKEAHP-Vishay-datasheet-62317933.pdf?src-supplier=element14+APAC; ComponentLink17URL: https://datasheet.octopart.com/CRCW0603100KFKEAHP-Vishay-datasheet-83567917.pdf; ComponentLink17Description: https://datasheet.octopart.com/CRCW0603100KFKEAHP-Vishay-datasheet-83567917.pdf; ComponentLink18URL: https://datasheet.octopart.com:443/CRCW0603100KFKEAHP-Vishay-Dale-datasheet-47688881.pdf?src-supplier=RS+(Formerly+Allied+Electronics); ComponentLink18Description: https://datasheet.octopart.com:443/CRCW0603100KFKEAHP-Vishay-Dale-datasheet-47688881.pdf?src-supplier=RS+(Formerly+Allied+Electronics); ComponentLink19URL: http://sigma.octopart.com:80/rohs_statement/Vishay-company-15.pdf?src-supplier=Compliance+Statements; ComponentLink19Description: http://sigma.octopart.com:80/rohs_statement/Vishay-company-15.pdf?src-supplier=Compliance+Statements
R32#1 R33#1 = Yageo RC0603FR-0710RL: Res Thick Film 0603 10 Ohm 1% 0.1W(1/10W) ±200ppm/C Pad SMD T/R

## Sheet Input filter.SchDoc
size A4; SheetNumber: 6; SheetTotal: 8
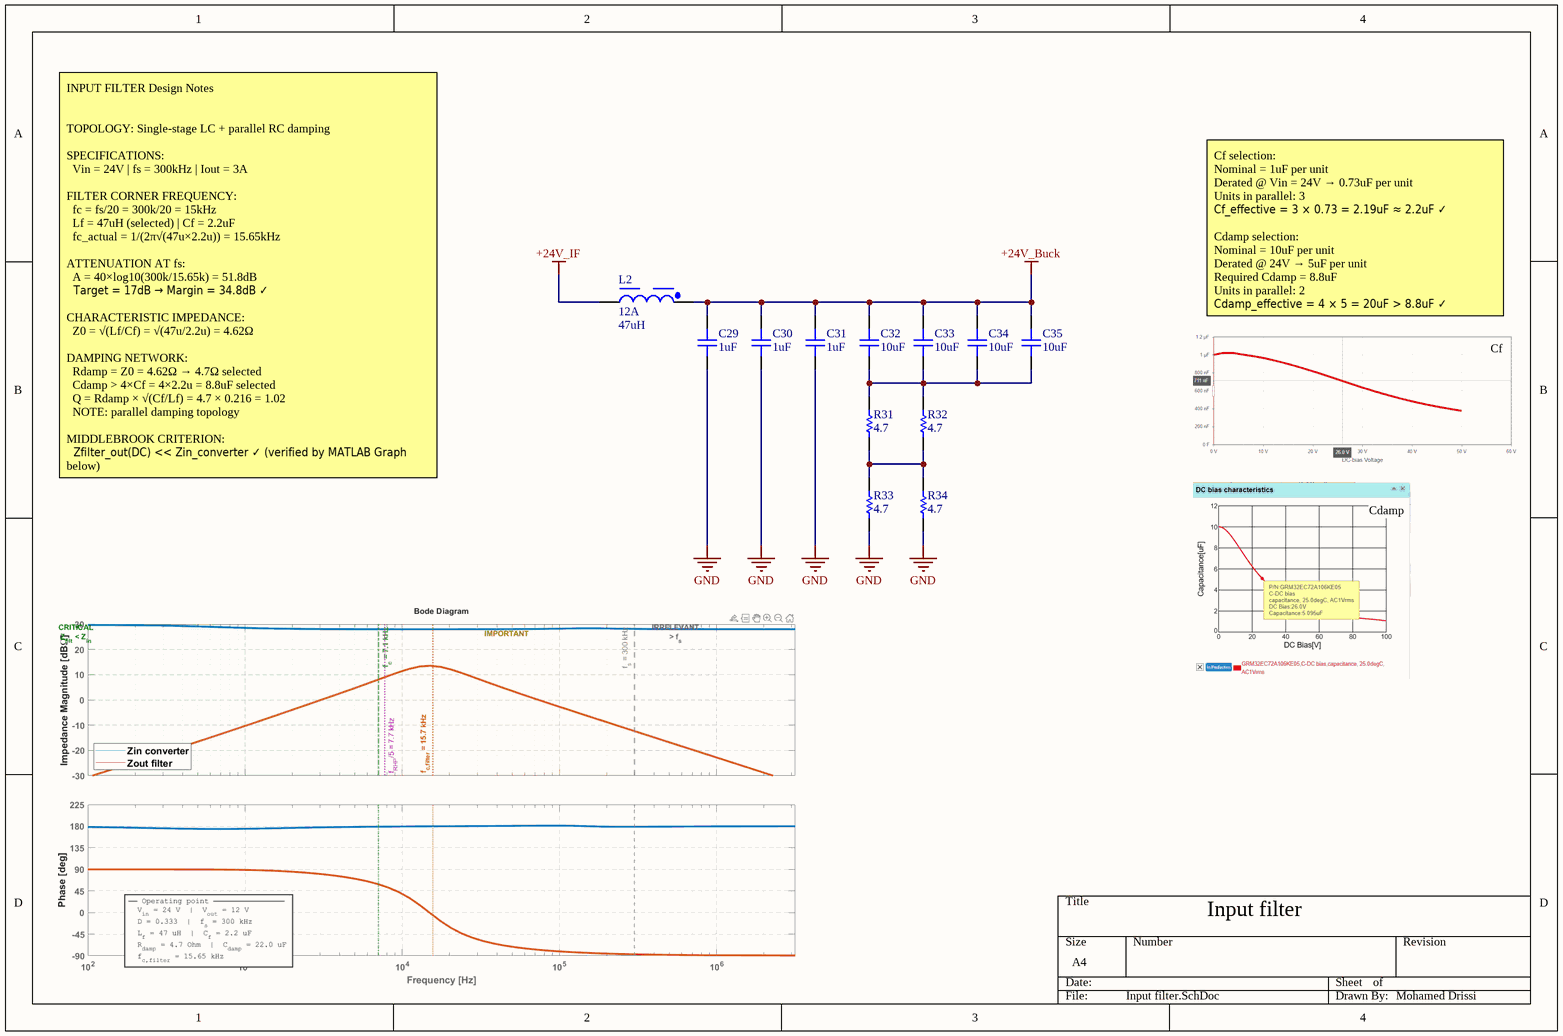
[diagram p4: Input filter.SchDoc]

### Parts
(Parts that share a designator on the sheet are numbered #1, #2 ... from top to bottom, then left to right.)
C29  Capacitance: 1uF  [cap_1206]  (hidden comment: 885382208005)
C30  Capacitance: 1uF  [cap_1206]  (hidden comment: 885382208005)
C31#2  Capacitance: 1uF  [cap_1206]  (hidden comment: 885382208005)
C32#2  Capacitance: 10uF  [cap_1210]  (hidden comment: 885012209073)
C33  Capacitance: 10uF  [cap_1210]  (hidden comment: 885012209073)
C34  Capacitance: 10uF  [cap_1210]  (hidden comment: 885012209073)
C35#1  Capacitance: 10uF  [cap_1210]  (hidden comment: 885012209073)
L2  Current Rating: 12A  Inductance: 47uH  [7443634700]  (hidden comment: 7443634700)
R31  Resistance: 4.7  [RES_2512]  (hidden comment: MFCR2512F4R70Q9R)
R32#2  Resistance: 4.7  [RES_2512]  (hidden comment: MFCR2512F4R70Q9R)
R33#2  Resistance: 4.7  [RES_2512]  (hidden comment: MFCR2512F4R70Q9R)
R34#1  Resistance: 4.7  [RES_2512]  (hidden comment: MFCR2512F4R70Q9R)

### Nets
+24V_Buck: C29.2 C30.2 C31#2.2 C32#2.2 C33.2 C34.2 C35#1.2 L2.2
+24V_IF: L2.1
GND: C29.1 C30.1 C31#2.1 R33#2.1 R34#1.1
NetC32#2_1: C32#2.1 C33.1 C34.1 C35#1.1 R31.2 R32#2.2
NetR31_1: R31.1 R32#2.1 R33#2.2 R34#1.2

### Notes on the sheet
- Cf selection:
  Nominal = 1uF per unit
  Derated @ Vin = 24V → 0.73uF per unit
  Units in parallel: 3
  Cf_effective = 3 × 0.73 = 2.19uF ≈ 2.2uF ✓
  Cdamp selection:
  Nominal = 10uF per unit
  Derated @ 24V → 5uF per unit
  Required Cdamp = 8.8uF
  Units in parallel: 2
  Cdamp_effective = 4 × 5 = 20uF > 8.8uF ✓
- Cf
- INPUT FILTER Design Notes
  TOPOLOGY: Single-stage LC + parallel RC damping
  SPECIFICATIONS:
  Vin = 24V | fs = 300kHz | Iout = 3A
  FILTER CORNER FREQUENCY:
  fc = fs/20 = 300k/20 = 15kHz
  Lf = 47uH (selected) | Cf = 2.2uF
  fc_actual = 1/(2π√(47u×2.2u)) = 15.65kHz
  ATTENUATION AT fs:
  A = 40×log10(300k/15.65k) = 51.8dB
  Target = 17dB → Margin = 34.8dB ✓
  CHARACTERISTIC IMPEDANCE:
  Z0 = √(Lf/Cf) = √(47u/2.2u) = 4.62Ω
  DAMPING NETWORK:
  Rdamp = Z0 = 4.62Ω → 4.7Ω selected
  Cdamp > 4×Cf = 4×2.2u = 8.8uF selected
  Q = Rdamp × √(Cf/Lf) = 4.7 × 0.216 = 1.02
  NOTE: parallel damping topology
  MIDDLEBROOK CRITERION:
  Zfilter_out(DC) << Zin_converter ✓ (verified by MATLAB Graph below)
- Cdamp
- Input filter
- Mohamed Drissi

### Library data of the parts
C29 C30 C31#2 = Wurth 885382208005: WCAP-CSST 1206 (3216Metric) ceramic capacitor 0.126Lx0.063W 3.20mmx1.60mm X7R ±10% 1muF; Manufacturer: Wurth Elektronik; Manufacturer Lifecycle Status: ACTIVE; Insulation Resistance: 500MΩ; Voltage Rating: 50V; YEOL: 1 = Estimated lifetime > 10 years; Supplier: RS; Supplier Part Number: 1855579; Manufacturer Part Number: 885382208005; RoHS: Compliant; Category: Ceramic Capacitors; Stock: 1375; Pricing: 25=0,187, 250=0,174, 625=0,158, 1250=0,139, 2500=0,118 (EUR); Case/Package: 1206; Dielectric: X7R; Height: 1.6mm; Length: 3.2mm; Lifecycle Status: Production; Max Operating Temperature: 125°C; Min Operating Temperature: -55°C; Voltage Rating (DC): 50V; Width: 1.6mm; ComponentLink1URL: https://datasheet.octopart.com:443/885382208005-W%C3%BCrth-Elektronik-datasheet-137006684.pdf?src-supplier=Wurth+Elektronik; ComponentLink1Description: https://datasheet.octopart.com:443/885382208005-W%C3%BCrth-Elektronik-datasheet-137006684.pdf?src-supplier=Wurth+Elektronik
C32#2 C33 C34 C35#1 = Wurth 885012209073: Cap, 10Uf, 50V, Mlcc, 1210 Rohs Compliant: Yes |Würth Elektronik 885012209073; Manufacturer: Wurth Elektronik; Manufacturer Lifecycle Status: ACTIVE; Insulation Resistance: 10MΩ; Material: Ceramic; Tolerance: 10%; YEOL: 1 = Estimated lifetime > 10 years; Supplier: RS; Supplier Part Number: 2571123; Manufacturer Part Number: 885012209073; RoHS: Compliant; Category: Ceramic Capacitors; Stock: 1289; Pricing: 10=1,153, 100=1,081, 200=1,009, 400=0,851, 500=0,799 (EUR); Case/Package: 1210; Height: 2.5mm; Length: 3.2mm; Lifecycle Status: Production; Max Operating Temperature: 125°C; Min Operating Temperature: -55°C; Voltage Rating: 50V; Width: 2.5mm; ComponentLink1URL: https://datasheet.octopart.com:443/885012209073-Wurth-Elektronik-datasheet-166092699.pdf?src-supplier=Newark; ComponentLink1Description: https://datasheet.octopart.com:443/885012209073-Wurth-Elektronik-datasheet-166092699.pdf?src-supplier=Newark; ComponentLink2URL: https://datasheet.octopart.com:443/885012209073-W%C3%BCrth-Elektronik-datasheet-137006727.pdf?src-supplier=Wurth+Elektronik; ComponentLink2Description: https://datasheet.octopart.com:443/885012209073-W%C3%BCrth-Elektronik-datasheet-137006727.pdf?src-supplier=Wurth+Elektronik
L2 = Wurth 7443634700: Power Choke Shielded Wirewound 47uH 15% 100KHz Ferrite 12A 0.01342Ohm DCR Automotive T/R; Manufacturer: Wurth Elektronik; Manufacturer Lifecycle Status: ACTIVE; DC Resistance (DCR): 12.2mΩ; Frequency: 10MHz; Saturation Current: 7.5A; YEOL: 1 = Estimated lifetime > 10 years; Supplier: RS; Supplier Part Number: 7445062P; Manufacturer Part Number: 7443634700; RoHS: Compliant; Category: Fixed Inductors; Stock: 86; Pricing: 10=5,04, 20=4,8, 50=4,49, 100=4,45 (EUR); Ambient Temperature Range High: 75°C; Ambient Temperature Range Low: -40°C; Case/Package: Nonstandard; Composition: Wirewound; Core Material: Ferrite; Depth: 21mm; Height: 13.5mm; Height - Seated (Max): 14.5034mm; Inductance Tolerance: 15%; Lead Free: Lead Free; Length: 20.8mm; Lifecycle Status: Production; Max DC Current: 12A; Max Operating Temperature: 125°C; Min Operating Temperature: -40°C; Mounting Technology: Surface Mount; Pins: 2; REACH SVHC: Unknown; RMS Current (Irms): 12A; Self Resonant Frequency: 10MHz; Shielding: Shielded; Termination: SMD/SMT; Test Frequency: 100kHz; Tolerance: 15%; Width: 20.5mm; ComponentLink1URL: https://datasheet.octopart.com:443/7443634700-Wurth-Elektronik-datasheet-168489618.pdf?src-supplier=Wurth+Elektronik; ComponentLink1Description: https://datasheet.octopart.com:443/7443634700-Wurth-Elektronik-datasheet-168489618.pdf?src-supplier=Wurth+Elektronik; ComponentLink2URL: https://datasheet.octopart.com:443/7443634700-W%C3%BCrth-Elektronik-datasheet-142021069.pdf?src-supplier=Upverter; ComponentLink2Description: https://datasheet.octopart.com:443/7443634700-W%C3%BCrth-Elektronik-datasheet-142021069.pdf?src-supplier=Upverter; ComponentLink3URL: https://datasheet.octopart.com:443/7443634700-Wurth-Elektronik-datasheet-181535134.pdf?src-supplier=Farnell; ComponentLink3Description: https://datasheet.octopart.com:443/7443634700-Wurth-Elektronik-datasheet-181535134.pdf?src-supplier=Farnell; ComponentLink4URL: https://datasheet.octopart.com:443/7443634700-W%C3%BCrth-Elektronik-datasheet-62112327.pdf?src-supplier=Future+Electronics; ComponentLink4Description: https://datasheet.octopart.com:443/7443634700-W%C3%BCrth-Elektronik-datasheet-62112327.pdf?src-supplier=Future+Electronics; ComponentLink5URL: https://datasheet.octopart.com:443/7443634700-W%C3%BCrth-Elektronik-datasheet-11479040.pdf?src-supplier=Newark; ComponentLink5Description: https://datasheet.octopart.com:443/7443634700-W%C3%BCrth-Elektronik-datasheet-11479040.pdf?src-supplier=Newark; ComponentLink6URL: https://datasheet.octopart.com:443/7443634700-Wurth-Elektronik-datasheet-182429432.pdf?src-supplier=Newark; ComponentLink6Description: https://datasheet.octopart.com:443/7443634700-Wurth-Elektronik-datasheet-182429432.pdf?src-supplier=Newark; ComponentLink7URL: https://datasheet.octopart.com:443/7443634700-W%C3%BCrth-Elektronik-datasheet-112299913.pdf?src-supplier=Newark; ComponentLink7Description: https://datasheet.octopart.com:443/7443634700-W%C3%BCrth-Elektronik-datasheet-112299913.pdf?src-supplier=Newark
R31 R32#2 R33#2 R34#1 = Resion MFCR2512F4R70Q9R: 4.7 Ohm 1% 2W 50PPM/C; Manufacturer: Resion; Supplier: DigiKey; Supplier Part Number: 4506-MFCR2512F4R70Q9RCT-ND; Manufacturer Part Number: MFCR2512F4R70Q9R; Category: Chip SMD Resistors; Stock: 1143; Pricing: 1=0,43, 10=0,238, 25=0,196, 50=0,1722, 100=0,1533, 250=0,13416, 500=0,12316, 1000=0,11441 (USD)

## Sheet Protections.SchDoc
size A4; SheetNumber: 7; SheetTotal: 8
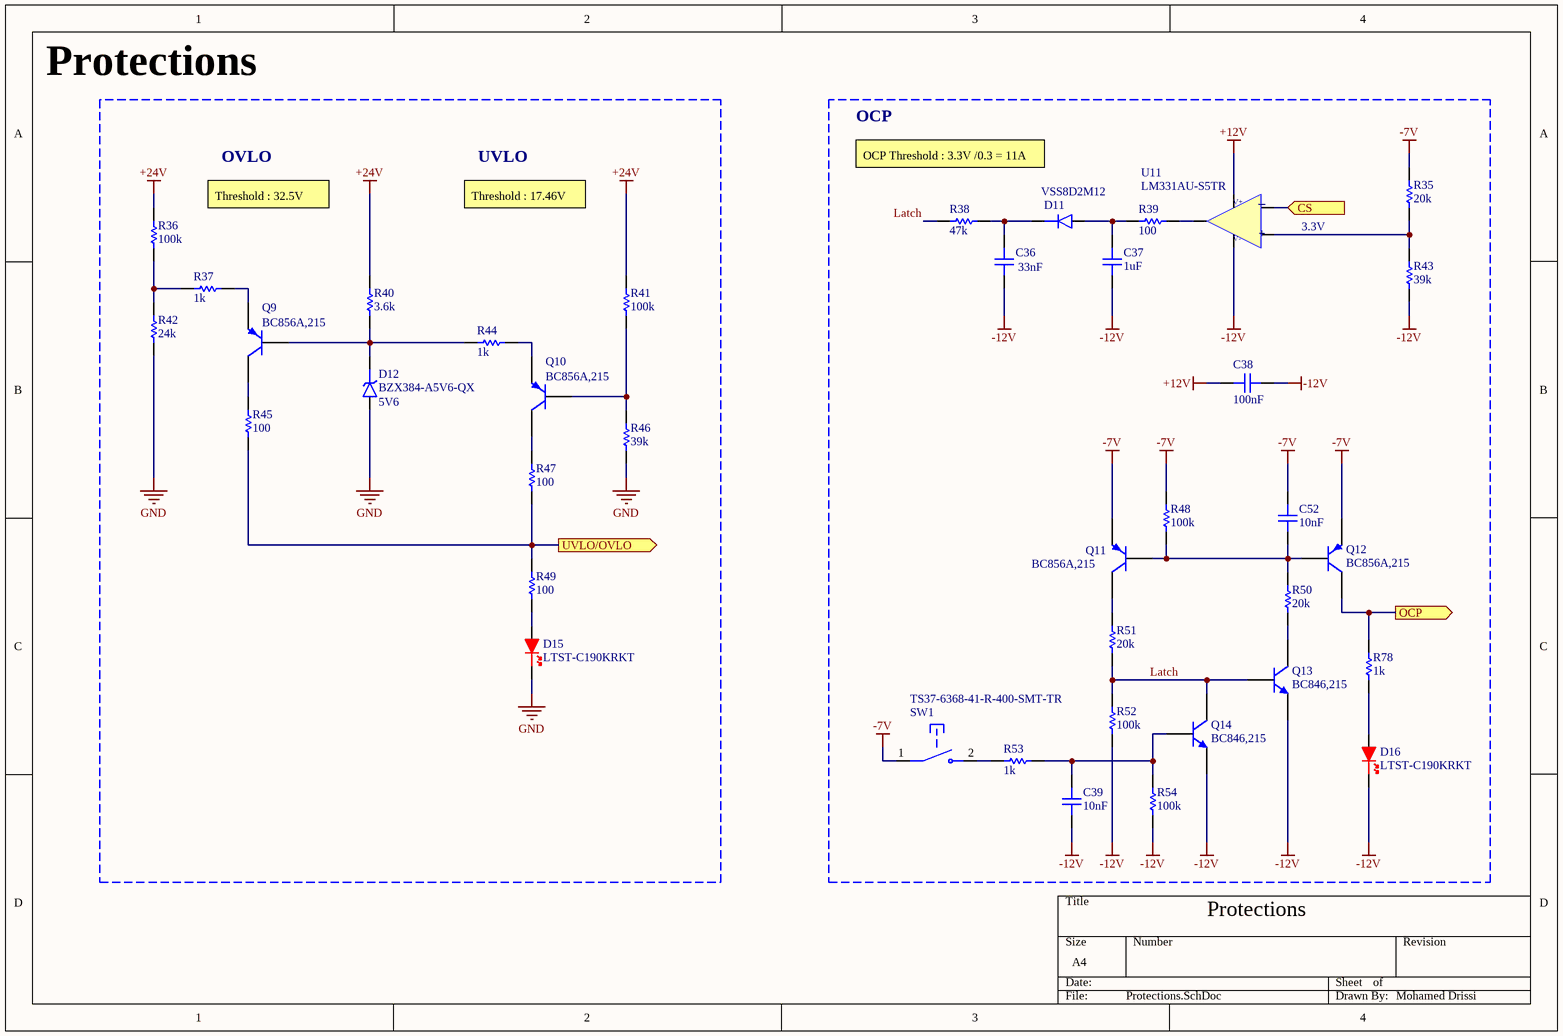
[diagram p5: Protections.SchDoc]

### Parts
C36  Capacitance: 33nF  [cap_0603]  (hidden comment: CC0603KRX7R0BB333)
C37  Capacitance: 1uF  [cap_1206]  (hidden comment: 885382208005)
C38  Capacitance: 100nF  [cap_0603]  (hidden comment: GMC10X7R104K100NT)
C39  Capacitance: 10nF  [cap_0603]  (hidden comment: C0603C103K4RACTU)
C52  Capacitance: 10nF  [cap_0603]  (hidden comment: C0603C103K4RACTU)
D11  VSS8D2M12  [DO-221AD]
D12  BZX384-A5V6-QX  Zener voltage: 5V6  [SOD-323]
D15  LTST-C190KRKT  [LED]
D16  LTST-C190KRKT  [LED]
Q9  BC856A,215  [sot23]
Q10  BC856A,215  [sot23]
Q11  BC856A,215  [sot23]
Q12  BC856A,215  [sot23]
Q13  BC846,215  [sot23]
Q14  BC846,215  [sot23]
R35  value 20k  [res_0603]  (hidden comment: CPF0603F20KC1)
R36  Resistance: 100k  [res_0603]  (hidden comment: CRCW0603100KFKEA)
R37  Resistance: 1k  [res_0603]  (hidden comment: RC0603FR-071KL)
R38  Resistance: 47k  [res_0603]  (hidden comment: RC0603FR-0747KL)
R39  Resistance: 100  [res_0603]  (hidden comment: RC0603FR-07100RL)
R40  Resistance: 3.6k  [res_0603]  (hidden comment: RC0603FR-073K6L)
R41  Resistance: 100k  [res_0603]  (hidden comment: CRCW0603100KFKEA)
R42  Resistance: 24k  [res_0603]  (hidden comment: RC0603FR-0724KL)
R43  value 39k  [res_0603]  (hidden comment: MCT06030C3902FP500)
R44  Resistance: 1k  [res_0603]  (hidden comment: RC0603FR-071KL)
R45  Resistance: 100  [res_0603]  (hidden comment: RC0603FR-07100RL)
R46  Resistance: 39k  [res_0603]  (hidden comment: RC0603FR-0739KL)
R47  Resistance: 100  [res_0603]  (hidden comment: RC0603FR-07100RL)
R48  Resistance: 100k  [res_0603]  (hidden comment: CRCW0603100KFKEA)
R49  Resistance: 100  [res_0603]  (hidden comment: RC0603FR-07100RL)
R50  value 20k  [res_0603]  (hidden comment: CPF0603F20KC1)
R51  value 20k  [res_0603]  (hidden comment: CPF0603F20KC1)
R52  Resistance: 100k  [res_0603]  (hidden comment: CRCW0603100KFKEA)
R53  Resistance: 1k  [res_0603]  (hidden comment: RC0603FR-071KL)
R54  Resistance: 100k  [res_0603]  (hidden comment: CRCW0603100KFKEA)
R78  Resistance: 1k  [res_0603]  (hidden comment: RC0603FR-071KL)
SW1  TS37-6368-41-R-400-SMT-TR  [TS37-6368-41-R-400-SMT-TR]
U11  LM331AU-S5TR  [5-Lead SOT-23]

### Blocks framed on the sheet
OCP: C36-C39 C52 D11 D16 Q11-Q14 R35 R38 R39 R43 R48 R50-R54 R78 SW1 U11

### Ports
CS (in, see Main[2C], Control circuit[2B], current sense[3B]), OCP (out, see Main[2C], Control circuit[1C]), UVLO/OVLO (out, see Main[2C], Input switch[2B])

### Nets
+12V: C38.2 U11.5(V+)
+24V: R36.2 R40.2 R41.2
-7V: C52.2 Q11.2(E) Q12.2(E) R35.2 R48.2 SW1.1
-12V: C36.1 C37.1 C38.1 C39.1 D16.K Q13.2(E) Q14.2(E) R43.1 R52.1 R54.1 U11.2(V-)
GND: D12.A D15.K R42.1 R46.1
Latch: Q13.1(B) Q14.3(C) R38.1 R51.1 R52.2
NetC36_2: C36.2 D11.C R38.2
NetC37_2: C37.2 D11.A R39.1
NetC39_2: C39.2 Q14.1(B) R53.2 R54.2
NetC52_1: C52.1 Q11.1(B) Q12.1(B) R48.1 R50.2
NetD12_K: D12.K Q9.1(B) R40.1 R44.1
NetD15_A: D15.A R49.1
NetD16_A: D16.A R78.1
NetQ3_2: Q12.3(C) R78.2 ; port OCP
NetQ8_1: R45.1 R47.1 R49.2 ; port UVLO/OVLO
NetQ9_2: Q9.2(E) R37.2
NetQ9_3: Q9.3(C) R45.2
NetQ10_1: Q10.1(B) R41.1 R46.2
NetQ10_2: Q10.2(E) R44.2
NetQ10_3: Q10.3(C) R47.2
NetQ11_3: Q11.3(C) R51.2
NetQ13_3: Q13.3(C) R50.1
NetR35_1: R35.1 R43.2 U11.1(IN-)
NetR36_1: R36.1 R37.1 R42.2
NetR39_2: R39.2 U11.4(OUT)
NetR53_1: R53.1 SW1.2
NetU6_1: U11.3(IN+) ; port CS

### Notes on the sheet
- Protections
- OVLO
- UVLO
- OCP Threshold : 3.3V /0.3 = 11A
- Threshold : 32.5V
- Threshold : 17.46V
- (near U11) 3.3V
- Mohamed Drissi
- (in symbol 3Peak LM331AU-S5TR) _; +